# Altium schematic sheet PIC18F4550.SchDoc
size A4; SheetNumber: 5; SheetTotal: 13
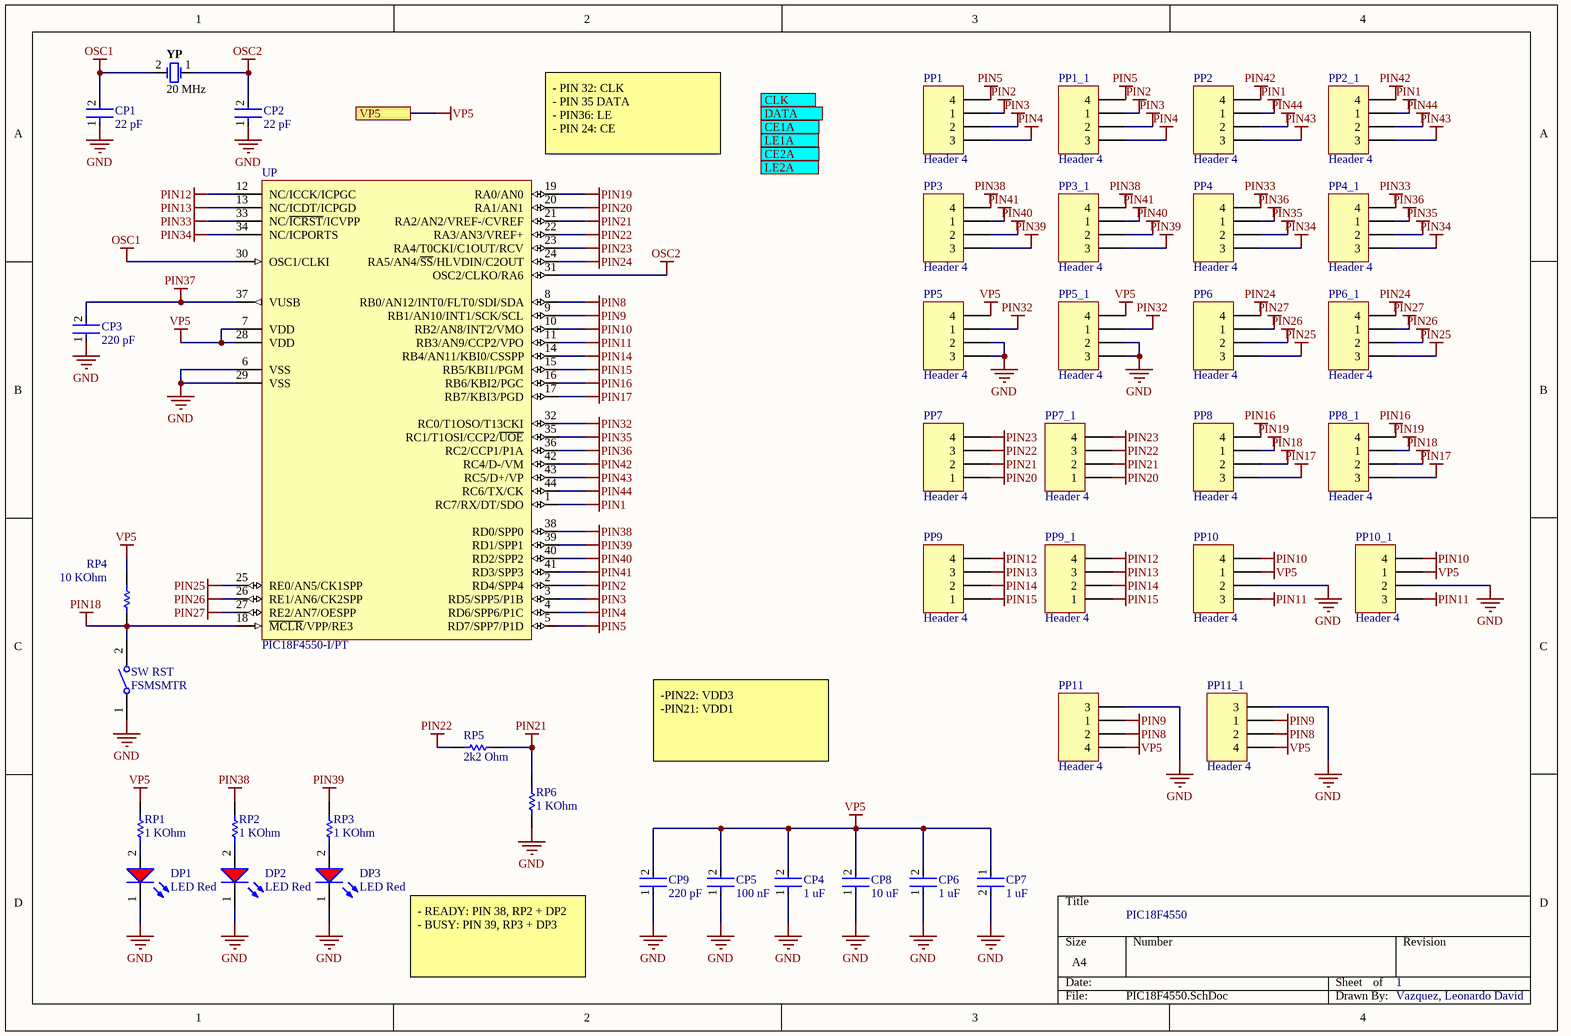
[diagram p0: PIC18F4550.SchDoc]

## Parts
CP1  22 pF  [FP-CC0805-0_85-MFG]
CP2  22 pF  [FP-CC0805-0_85-MFG]
CP3  220 pF  [FP-CC0805-0_85-MFG]
CP4  1 uF  [FP-CC0805-0_85-MFG]
CP5  100 nF  [FP-CC0805-0_85-MFG]
CP6  1 uF  [FP-CC0805-0_85-MFG]
CP7  1 uF  [FP-CC0805-0_85-MFG]
CP8  10 uF  [FP-CC0805-0_85-MFG]
CP9  220 pF  [FP-CC0805-0_85-MFG]
DP1  LED Red  [WL-SMCW_0805_150080xx75000]
DP2  LED Red  [WL-SMCW_0805_150080xx75000]
DP3  LED Red  [WL-SMCW_0805_150080xx75000]
PP1  Header 4  [HDR1X4]
PP1_1  Header 4  [HDR1X4]
PP2  Header 4  [HDR1X4]
PP2_1  Header 4  [HDR1X4]
PP3  Header 4  [HDR1X4]
PP3_1  Header 4  [HDR1X4]
PP4  Header 4  [HDR1X4]
PP4_1  Header 4  [HDR1X4]
PP5  Header 4  [HDR1X4]
PP5_1  Header 4  [HDR1X4]
PP6  Header 4  [HDR1X4]
PP6_1  Header 4  [HDR1X4]
PP7  Header 4  [HDR1X4]
PP7_1  Header 4  [HDR1X4]
PP8  Header 4  [HDR1X4]
PP8_1  Header 4  [HDR1X4]
PP9  Header 4  [HDR1X4]
PP9_1  Header 4  [HDR1X4]
PP10  Header 4  [HDR1X4]
PP10_1  Header 4  [HDR1X4]
PP11  Header 4  [HDR1X4]
PP11_1  Header 4  [HDR1X4]
RP1  1 KOhm  [RESC2013X60X40ML20T25]
RP2  1 KOhm  [RESC2013X60X40ML20T25]
RP3  1 KOhm  [RESC2013X60X40ML20T25]
RP4  10 KOhm  [RESC2013X60X40ML20T25]
RP5  2k2 Ohm  [RESC2013X60X40ML20T25]
RP6  1 KOhm  [RESC2013X60X40ML20T25]
SW_RST  FSMSMTR  [TECO-FSMSMTR_V]
UP  PIC18F4550-I/PT  [TQFP-PT44_M]
YP  20 MHz  [FOX-FOXSLF160-20]

## Ports
CE1A (out, see uVNA[1B], ADF4351_10X2_v1[1D], Data_converter[1A]), CE2A (out, see uVNA[1B], ADF4351_10X2_v1[1D], Data_converter[3A]), CLK (out, see uVNA[1B], ADF4351_10X2_v1[1D]), DATA (out, see uVNA[1B], ADF4351_10X2_v1[1D]), LE1A (out, see uVNA[1B], ADF4351_10X2_v1[1D], Data_converter[1C]), LE2A (out, see uVNA[1B], ADF4351_10X2_v1[1D], Data_converter[3C]), VP5 (see uVNA[1A])

## Nets
GND: CP1.1 CP2.1 CP3.1 CP4.1 CP5.1 CP6.1 CP7.2 CP8.1 CP9.1 DP1.1(K) DP2.1(K) DP3.1(K) PP5.2 PP5.3 PP5_1.2 PP5_1.3 PP10.2 PP10_1.2 PP11.3 PP11_1.3 RP6.1 SW_RST.1 UP.6(VSS) UP.29(VSS)
OSC1: CP1.2 UP.30(OSC1/CLKI) YP.2
OSC2: CP2.2 UP.31(OSC2/CLKO/RA6) YP.1
PIN1: PP2.1 PP2_1.1 UP.1(RC7/RX/DT/SDO)
PIN2: PP1.1 PP1_1.1 UP.2(RD4/SPP4)
PIN3: PP1.2 PP1_1.2 UP.3(RD5/SPP5/P1B)
PIN4: PP1.3 PP1_1.3 UP.4(RD6/SPP6/P1C)
PIN5: PP1.4 PP1_1.4 UP.5(RD7/SPP7/P1D)
PIN8: PP11.2 PP11_1.2 UP.8(RB0/AN12/INT0/FLT0/SDI/SDA)
PIN9: PP11.1 PP11_1.1 UP.9(RB1/AN10/INT1/SCK/SCL)
PIN10: PP10.4 PP10_1.4 UP.10(RB2/AN8/INT2/VMO)
PIN11: PP10.3 PP10_1.3 UP.11(RB3/AN9/CCP2/VPO)
PIN12: PP9.4 PP9_1.4 UP.12(NC/ICCK/ICPGC)
PIN13: PP9.3 PP9_1.3 UP.13(NC/ICDT/ICPGD)
PIN14: PP9.2 PP9_1.2 UP.14(RB4/AN11/KBI0/CSSPP)
PIN15: PP9.1 PP9_1.1 UP.15(RB5/KBI1/PGM)
PIN16: PP8.4 PP8_1.4 UP.16(RB6/KBI2/PGC)
PIN17: PP8.3 PP8_1.3 UP.17(RB7/KBI3/PGD)
PIN18: PP8.2 PP8_1.2 RP4.1 SW_RST.2 UP.18(~{MCLR}/VPP/RE3)
PIN19: PP8.1 PP8_1.1 UP.19(RA0/AN0)
PIN20: PP7.1 PP7_1.1 UP.20(RA1/AN1)
PIN21: PP7.2 PP7_1.2 RP5.1 RP6.2 UP.21(RA2/AN2/VREF-/CVREF)
PIN22: PP7.3 PP7_1.3 RP5.2 UP.22(RA3/AN3/VREF+)
PIN23: PP7.4 PP7_1.4 UP.23(RA4/T0CKI/C1OUT/RCV)
PIN24: PP6.4 PP6_1.4 UP.24(RA5/AN4/~{SS}/HLVDIN/C2OUT)
PIN25: PP6.3 PP6_1.3 UP.25(RE0/AN5/CK1SPP)
PIN26: PP6.2 PP6_1.2 UP.26(RE1/AN6/CK2SPP)
PIN27: PP6.1 PP6_1.1 UP.27(RE2/AN7/OESPP)
PIN32: PP5.1 PP5_1.1 UP.32(RC0/T1OSO/T13CKI)
PIN33: PP4.4 PP4_1.4 UP.33(NC/~{ICRST}/ICVPP)
PIN34: PP4.3 PP4_1.3 UP.34(NC/ICPORTS)
PIN35: PP4.2 PP4_1.2 UP.35(RC1/T1OSI/CCP2/~{UOE})
PIN36: PP4.1 PP4_1.1 UP.36(RC2/CCP1/P1A)
PIN37: CP3.2 UP.37(VUSB)
PIN38: PP3.4 PP3_1.4 RP2.2 UP.38(RD0/SPP0)
PIN39: PP3.3 PP3_1.3 RP3.2 UP.39(RD1/SPP1)
PIN40: PP3.2 PP3_1.2 UP.40(RD2/SPP2)
PIN41: PP3.1 PP3_1.1 UP.41(RD3/SPP3)
PIN42: PP2.4 PP2_1.4 UP.42(RC4/D-/VM)
PIN43: PP2.3 PP2_1.3 UP.43(RC5/D+/VP)
PIN44: PP2.2 PP2_1.2 UP.44(RC6/TX/CK)
VP5: CP4.2 CP5.2 CP6.2 CP7.1 CP8.2 CP9.2 PP5.4 PP5_1.4 PP10.1 PP10_1.1 PP11.4 PP11_1.4 RP1.2 RP4.2 UP.7(VDD) UP.28(VDD) ; port VP5
NetDP1_2: DP1.2(A) RP1.1
NetDP2_2: DP2.2(A) RP2.1
NetDP3_2: DP3.2(A) RP3.1

## Notes on the sheet
- (near UP) - PIN 32: CLK
  - PIN 35 DATA
  - PIN36: LE
  - PIN 24: CE
- -PIN22: VDD3
  -PIN21: VDD1
- PIC18F4550
- - READY: PIN 38, RP2 + DP2
  - BUSY: PIN 39, RP3 + DP3
- 1
- Vazquez, Leonardo David

## Library data of the parts
CP1-CP4 CP6-CP9 = CMP-2100-03606-3: CAP CER 0.1UF 50V X7R 0805; Manufacturer Part Number: CC0805KRX7R9BB104; Manufacturer: Yageo; Tolerance: 0.1; Capacitance: 100 nF; Value: 100 nF; Device Class L1: Passive Components; ComponentLink2Description: Datasheet; Package: CC0805-0.85; Digikey Description: CAP CER 0.1UF 50V X7R 0805; Device Class L3: Ceramic Capacitors; Temperature: -30°C to +85°C; Temperature Characteristic: X7R; Voltage Rating: 50 V; Height: 0.95mm; RoHS: TRUE; Ipc Land Pattern Name: CAPC200125X85; Device Class L2: Capacitors; Category: Cap; Temperature Range Low: -30°C; Temperature Range High: +85°C; Material: Ceramic; Mouser Description: Multilayer Ceramic Capacitors MLCC - SMD/SMT 100nF 50V X7R 10%; Footprint Url: http://www.yageo.com/exep/pages/download/literatures/UPY-C_GEN_24.pdf; Automotive: No; Octopart: https://octopart.com/cc0805krx7r9bb104-yageo-192993; Lead Free: Yes; ComponentLink2URL: http://www.yageo.com/documents/recent/UPY-GPHC_Y5V_6.3V-to-50V_8.pdf
CP5 = CMP-2100-03606-3: CAP CER 0.1UF 50V X7R 0805; Manufacturer Part Number: CC0805KRX7R9BB104; Manufacturer: Yageo; Tolerance: 0.1; Device Class L1: Passive Components; ComponentLink2Description: Datasheet; Package: CC0805-0.85; Digikey Description: CAP CER 0.1UF 50V X7R 0805; Capacitance: 100 nF; Device Class L3: Ceramic Capacitors; Value: 100 nF; Temperature: -30°C to +85°C; Temperature Characteristic: X7R; Voltage Rating: 50 V; Height: 0.95mm; RoHS: TRUE; Ipc Land Pattern Name: CAPC200125X85; Device Class L2: Capacitors; Category: Cap; Temperature Range Low: -30°C; Temperature Range High: +85°C; Material: Ceramic; Mouser Description: Multilayer Ceramic Capacitors MLCC - SMD/SMT 100nF 50V X7R 10%; Footprint Url: http://www.yageo.com/exep/pages/download/literatures/UPY-C_GEN_24.pdf; Automotive: No; Octopart: https://octopart.com/cc0805krx7r9bb104-yageo-192993; Lead Free: Yes; ComponentLink2URL: http://www.yageo.com/documents/recent/UPY-GPHC_Y5V_6.3V-to-50V_8.pdf
DP1-DP3 = CMP-1426-00011-2: NexarPartId: 29717781; Peak Wavelength: 630nm; Wavelength: 625nm; Viewing Angle: 140°; Test Current: 20mA; Forward Voltage: 2V; Forward Current: 100mA; Lens Style: Clear, Rectangular; Luminous Intensity: 150mcd; Max Reverse Voltage (DC): 5V; Length: 2mm; Case Code (Imperial): 0805; RoHS: Compliant; Max Operating Temperature: 85°C; Height: 700µm; Packaging: Tape and Reel; Color: Red; Case/Package: 0805; REACH SVHC: Unknown; Dominant Wavelength: 625nm; Min Operating Temperature: -40°C; Case Code (Metric): 2012; Mount: Surface Mount; Width: 1.25mm
PP1 PP1_1 PP2 PP2_1 PP3 PP3_1 PP4 PP4_1 PP5 PP5_1 PP6 PP6_1 PP7 PP7_1 PP8 PP8_1 PP9 PP9_1 PP10 PP10_1 PP11 PP11_1 = Header 4: Header, 4-Pin; LatestRevisionDate: 17-Jul-2002; LatestRevisionNote: Re-released for DXP Platform.; Publisher: Altium Limited
RP1-RP6 = CMP-2001-00580-1: Manufacturer: Panasonic; Part Number: ERA6AEB101V
SW_RST = CMP-2000-07501-1: FSMSM Push Button Switch, 50 mA, -35 to 85 degC, 2-Pin SMD, RoHS, Tape and Reel; Manufacturer: TE Connectivity; Voltage Rating (DC): 24V; Electrical Life: 20000Cycles; Operating Force: 180gf; Switch Travel: 0.25mm; Contact Current Rating: 50mA; Case\/Package: SMD/SMT; Actuator Length: 1.07mm; Throw Configuration: SPST; Actuator Material: Polyamide; Contact Resistance: 100mOhm; Illumination Type: Illuminated; Max Voltage Rating (DC): 12V; Manufacturer URL: http://www.te.com/; Lead Free: LeadFree; Packaging: TapeandReel; Min Operating Temperature: -35degC; Mechanical Life: 20000Cycles; Mount: SurfaceMount; REACH SVHC: Unknown; Package Quantity: 1800; Package Reference: FSMSMTR; RoHSCompliant: true; Max Operating Temperature: 85degC; Orientation: Straight; ELV: Compliant; Datasheet URL: http://www.te.com/commerce/DocumentDelivery/DDEController?Action=showdoc&DocId=Customer+Drawing%7F1437566-3%7FC2%7Fpdf%7FEnglish%7FENG_CD_1437566-3_C2_1437566_3_1_c.dwg.pdf%7F1437566-4; Package Description: 2-Pin Surface Mount Device, Body 6 x 3.5 mm, Pitch 9.19 mm; Current Rating: 50mA; Contact Plating: Silver; Termination: GullWing; Datasheet Version: Rev. C2, 08/2014; Contact Material: Brass; Mounting Technology: SurfaceMount
UP = CMP-0116-00956-1: High Performance, Enhanced Flash, USB Microcontroller with nanoWatt Technology, 32K Flash, 44-Pin TQFP, Industrial Temperature Range; Code_JEDEC: MS-026; PackageReference: TQFP-PT44; DatasheetVersion: revE, Aug-2008; PackageDescription: 44-Lead Plastic Thin Quad Flatpack (PT) - 10x10x1mm Body, 2.00mm [TQFP]; PackageVersion: revBB, Aug-2009
YP = CMP-1749-00003-1: Resistance Weld Thru-Hole Crystal, 16 MHz, -20 to 70 degC, 2-Pin THD, RoHS, Bulk; Voltage Rating: 250 V; Tolerance: 1%; Resistance: 221 kohm; Case\Package: Axial; Power Rating: 250 mW; RoHSCompliant: true; Package Quantity: 200; Packaging: Bulk; Min Operating Temperature: -55 degC; DatasheetVersion: Mar-15; ComponentLink1URL: http://www.foxonline.com/; Max Operating Temperature: 155 degC; PackageReference: FOXSLF160-20; Mount: Through Hole; PackageDescription: 2-Pin Through Hole Device, Body 11.35 x 4.65 mm; ComponentLink1Description: Manufacturer URL; ComponentLink2URL: http://www.foxonline.com/pdfs/hc49slf.pdf; ComponentLink2Description: Datasheet; Length: 0.248 inch